# Altium schematic sheet HBridge.SchDoc
size A
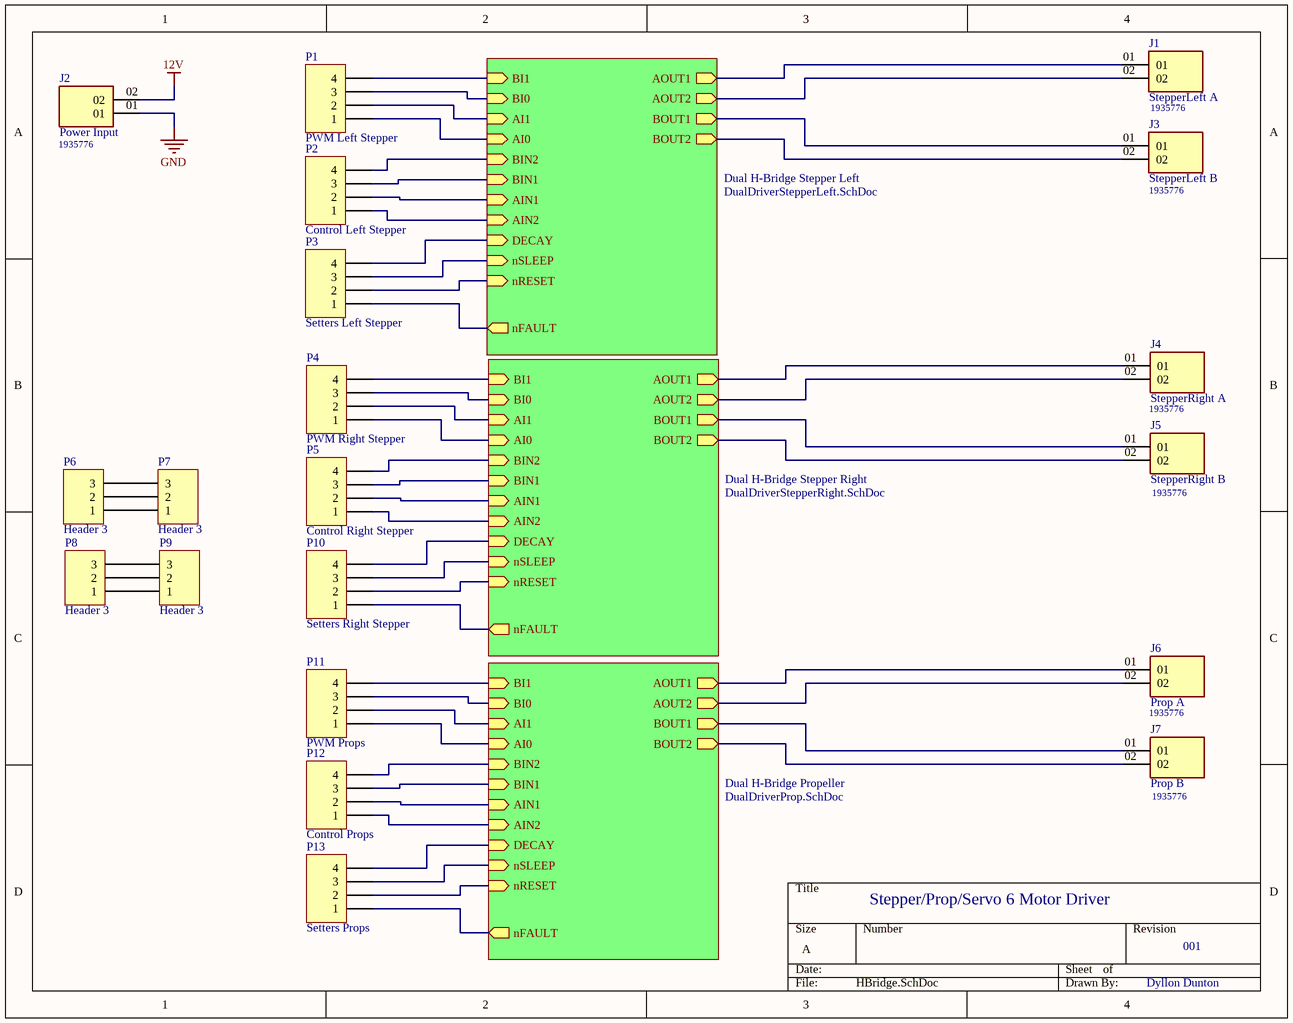
[diagram p0: HBridge.SchDoc]

## Parts
J1  StepperLeft A  [PHOENIX_1935776]
J2  Power Input  [PHOENIX_1935776]
J3  StepperLeft B  [PHOENIX_1935776]
J4  StepperRight A  [PHOENIX_1935776]
J5  StepperRight B  [PHOENIX_1935776]
J6  Prop A  [PHOENIX_1935776]
J7  Prop B  [PHOENIX_1935776]
P1  PWM Left Stepper  [HDR1X4]
P2  Control Left Stepper  [HDR1X4]
P3  Setters Left Stepper  [HDR1X4]
P4  PWM Right Stepper  [HDR1X4]
P5  Control Right Stepper  [HDR1X4]
P6  Header 3  [HDR1X3]
P7  Header 3  [HDR1X3]
P8  Header 3  [HDR1X3]
P9  Header 3  [HDR1X3]
P10  Setters Right Stepper  [HDR1X4]
P11  PWM Props  [HDR1X4]
P12  Control Props  [HDR1X4]
P13  Setters Props  [HDR1X4]

## Sub-sheets
Dual H-Bridge Propeller = DualDriverProp.SchDoc: BI1 (in), BI0 (in), AI1 (in), AI0 (in), BIN2 (in), BIN1 (in), AIN1 (in), AIN2 (in), DECAY (in), nSLEEP (in), nRESET (in), nFAULT (out), AOUT1 (out), AOUT2 (out), BOUT1 (out), BOUT2 (out)
Dual H-Bridge Stepper Left = DualDriverStepperLeft.SchDoc: BI1 (in), BI0 (in), AI1 (in), AI0 (in), BIN2 (in), BIN1 (in), AIN1 (in), AIN2 (in), DECAY (in), nSLEEP (in), nRESET (in), nFAULT (out), AOUT1 (out), AOUT2 (out), BOUT1 (out), BOUT2 (out)
Dual H-Bridge Stepper Right = DualDriverStepperRight.SchDoc: BI1 (in), BI0 (in), AI1 (in), AI0 (in), BIN2 (in), BIN1 (in), AIN1 (in), AIN2 (in), DECAY (in), nSLEEP (in), nRESET (in), nFAULT (out), AOUT1 (out), AOUT2 (out), BOUT1 (out), BOUT2 (out)

## Nets
12V: J2.02
GND: J2.01
NetJ1_01: J1.01 ; sheet Dual H-Bridge Stepper Left/AOUT1
NetJ1_02: J1.02 ; sheet Dual H-Bridge Stepper Left/AOUT2
NetJ3_01: J3.01 ; sheet Dual H-Bridge Stepper Left/BOUT1
NetJ3_02: J3.02 ; sheet Dual H-Bridge Stepper Left/BOUT2
NetJ4_01: J4.01 ; sheet Dual H-Bridge Stepper Right/AOUT1
NetJ4_02: J4.02 ; sheet Dual H-Bridge Stepper Right/AOUT2
NetJ5_01: J5.01 ; sheet Dual H-Bridge Stepper Right/BOUT1
NetJ5_02: J5.02 ; sheet Dual H-Bridge Stepper Right/BOUT2
NetJ6_01: J6.01 ; sheet Dual H-Bridge Propeller/AOUT1
NetJ6_02: J6.02 ; sheet Dual H-Bridge Propeller/AOUT2
NetJ7_01: J7.01 ; sheet Dual H-Bridge Propeller/BOUT1
NetJ7_02: J7.02 ; sheet Dual H-Bridge Propeller/BOUT2
NetP1_1: P1.1 ; sheet Dual H-Bridge Stepper Left/AI0
NetP1_2: P1.2 ; sheet Dual H-Bridge Stepper Left/AI1
NetP1_3: P1.3 ; sheet Dual H-Bridge Stepper Left/BI0
NetP1_4: P1.4 ; sheet Dual H-Bridge Stepper Left/BI1
NetP2_1: P2.1 ; sheet Dual H-Bridge Stepper Left/AIN2
NetP2_2: P2.2 ; sheet Dual H-Bridge Stepper Left/AIN1
NetP2_3: P2.3 ; sheet Dual H-Bridge Stepper Left/BIN1
NetP2_4: P2.4 ; sheet Dual H-Bridge Stepper Left/BIN2
NetP3_1: P3.1 ; sheet Dual H-Bridge Stepper Left/nFAULT
NetP3_2: P3.2 ; sheet Dual H-Bridge Stepper Left/nRESET
NetP3_3: P3.3 ; sheet Dual H-Bridge Stepper Left/nSLEEP
NetP3_4: P3.4 ; sheet Dual H-Bridge Stepper Left/DECAY
NetP4_1: P4.1 ; sheet Dual H-Bridge Stepper Right/AI0
NetP4_2: P4.2 ; sheet Dual H-Bridge Stepper Right/AI1
NetP4_3: P4.3 ; sheet Dual H-Bridge Stepper Right/BI0
NetP4_4: P4.4 ; sheet Dual H-Bridge Stepper Right/BI1
NetP5_1: P5.1 ; sheet Dual H-Bridge Stepper Right/AIN2
NetP5_2: P5.2 ; sheet Dual H-Bridge Stepper Right/AIN1
NetP5_3: P5.3 ; sheet Dual H-Bridge Stepper Right/BIN1
NetP5_4: P5.4 ; sheet Dual H-Bridge Stepper Right/BIN2
NetP6_1: P6.1 P7.1
NetP6_2: P6.2 P7.2
NetP6_3: P6.3 P7.3
NetP8_1: P8.1 P9.1
NetP8_2: P8.2 P9.2
NetP8_3: P8.3 P9.3
NetP10_1: P10.1 ; sheet Dual H-Bridge Stepper Right/nFAULT
NetP10_2: P10.2 ; sheet Dual H-Bridge Stepper Right/nRESET
NetP10_3: P10.3 ; sheet Dual H-Bridge Stepper Right/nSLEEP
NetP10_4: P10.4 ; sheet Dual H-Bridge Stepper Right/DECAY
NetP11_1: P11.1 ; sheet Dual H-Bridge Propeller/AI0
NetP11_2: P11.2 ; sheet Dual H-Bridge Propeller/AI1
NetP11_3: P11.3 ; sheet Dual H-Bridge Propeller/BI0
NetP11_4: P11.4 ; sheet Dual H-Bridge Propeller/BI1
NetP12_1: P12.1 ; sheet Dual H-Bridge Propeller/AIN2
NetP12_2: P12.2 ; sheet Dual H-Bridge Propeller/AIN1
NetP12_3: P12.3 ; sheet Dual H-Bridge Propeller/BIN1
NetP12_4: P12.4 ; sheet Dual H-Bridge Propeller/BIN2
NetP13_1: P13.1 ; sheet Dual H-Bridge Propeller/nFAULT
NetP13_2: P13.2 ; sheet Dual H-Bridge Propeller/nRESET
NetP13_3: P13.3 ; sheet Dual H-Bridge Propeller/nSLEEP
NetP13_4: P13.4 ; sheet Dual H-Bridge Propeller/DECAY

## Notes on the sheet
- (near J2) 1935776
- 1935776
- (near J3) 1935776
- (near J5) 1935776
- (near J7) 1935776
- Stepper/Prop/Servo 6 Motor Driver
- 001
- Dyllon Dunton

## Library data of the parts
J1-J7 = 1935776: Package: None; MP: 1935776; Availability: Unavailable; Price: None; Value: *
P1-P5 P10-P13 = Header 4: Header, 4-Pin; LatestRevisionDate: 17-Jul-2002; LatestRevisionNote: Re-released for DXP Platform.; Publisher: Altium Limited
P6-P9 = Header 3: Header, 3-Pin; LatestRevisionDate: 17-Jul-2002; LatestRevisionNote: Re-released for DXP Platform.; Publisher: Altium Limited